# Altium schematic sheet IMU_sensor_mcu.SchDoc
size 594 x 420 mm; SheetNumber: 1; SheetTotal: 4
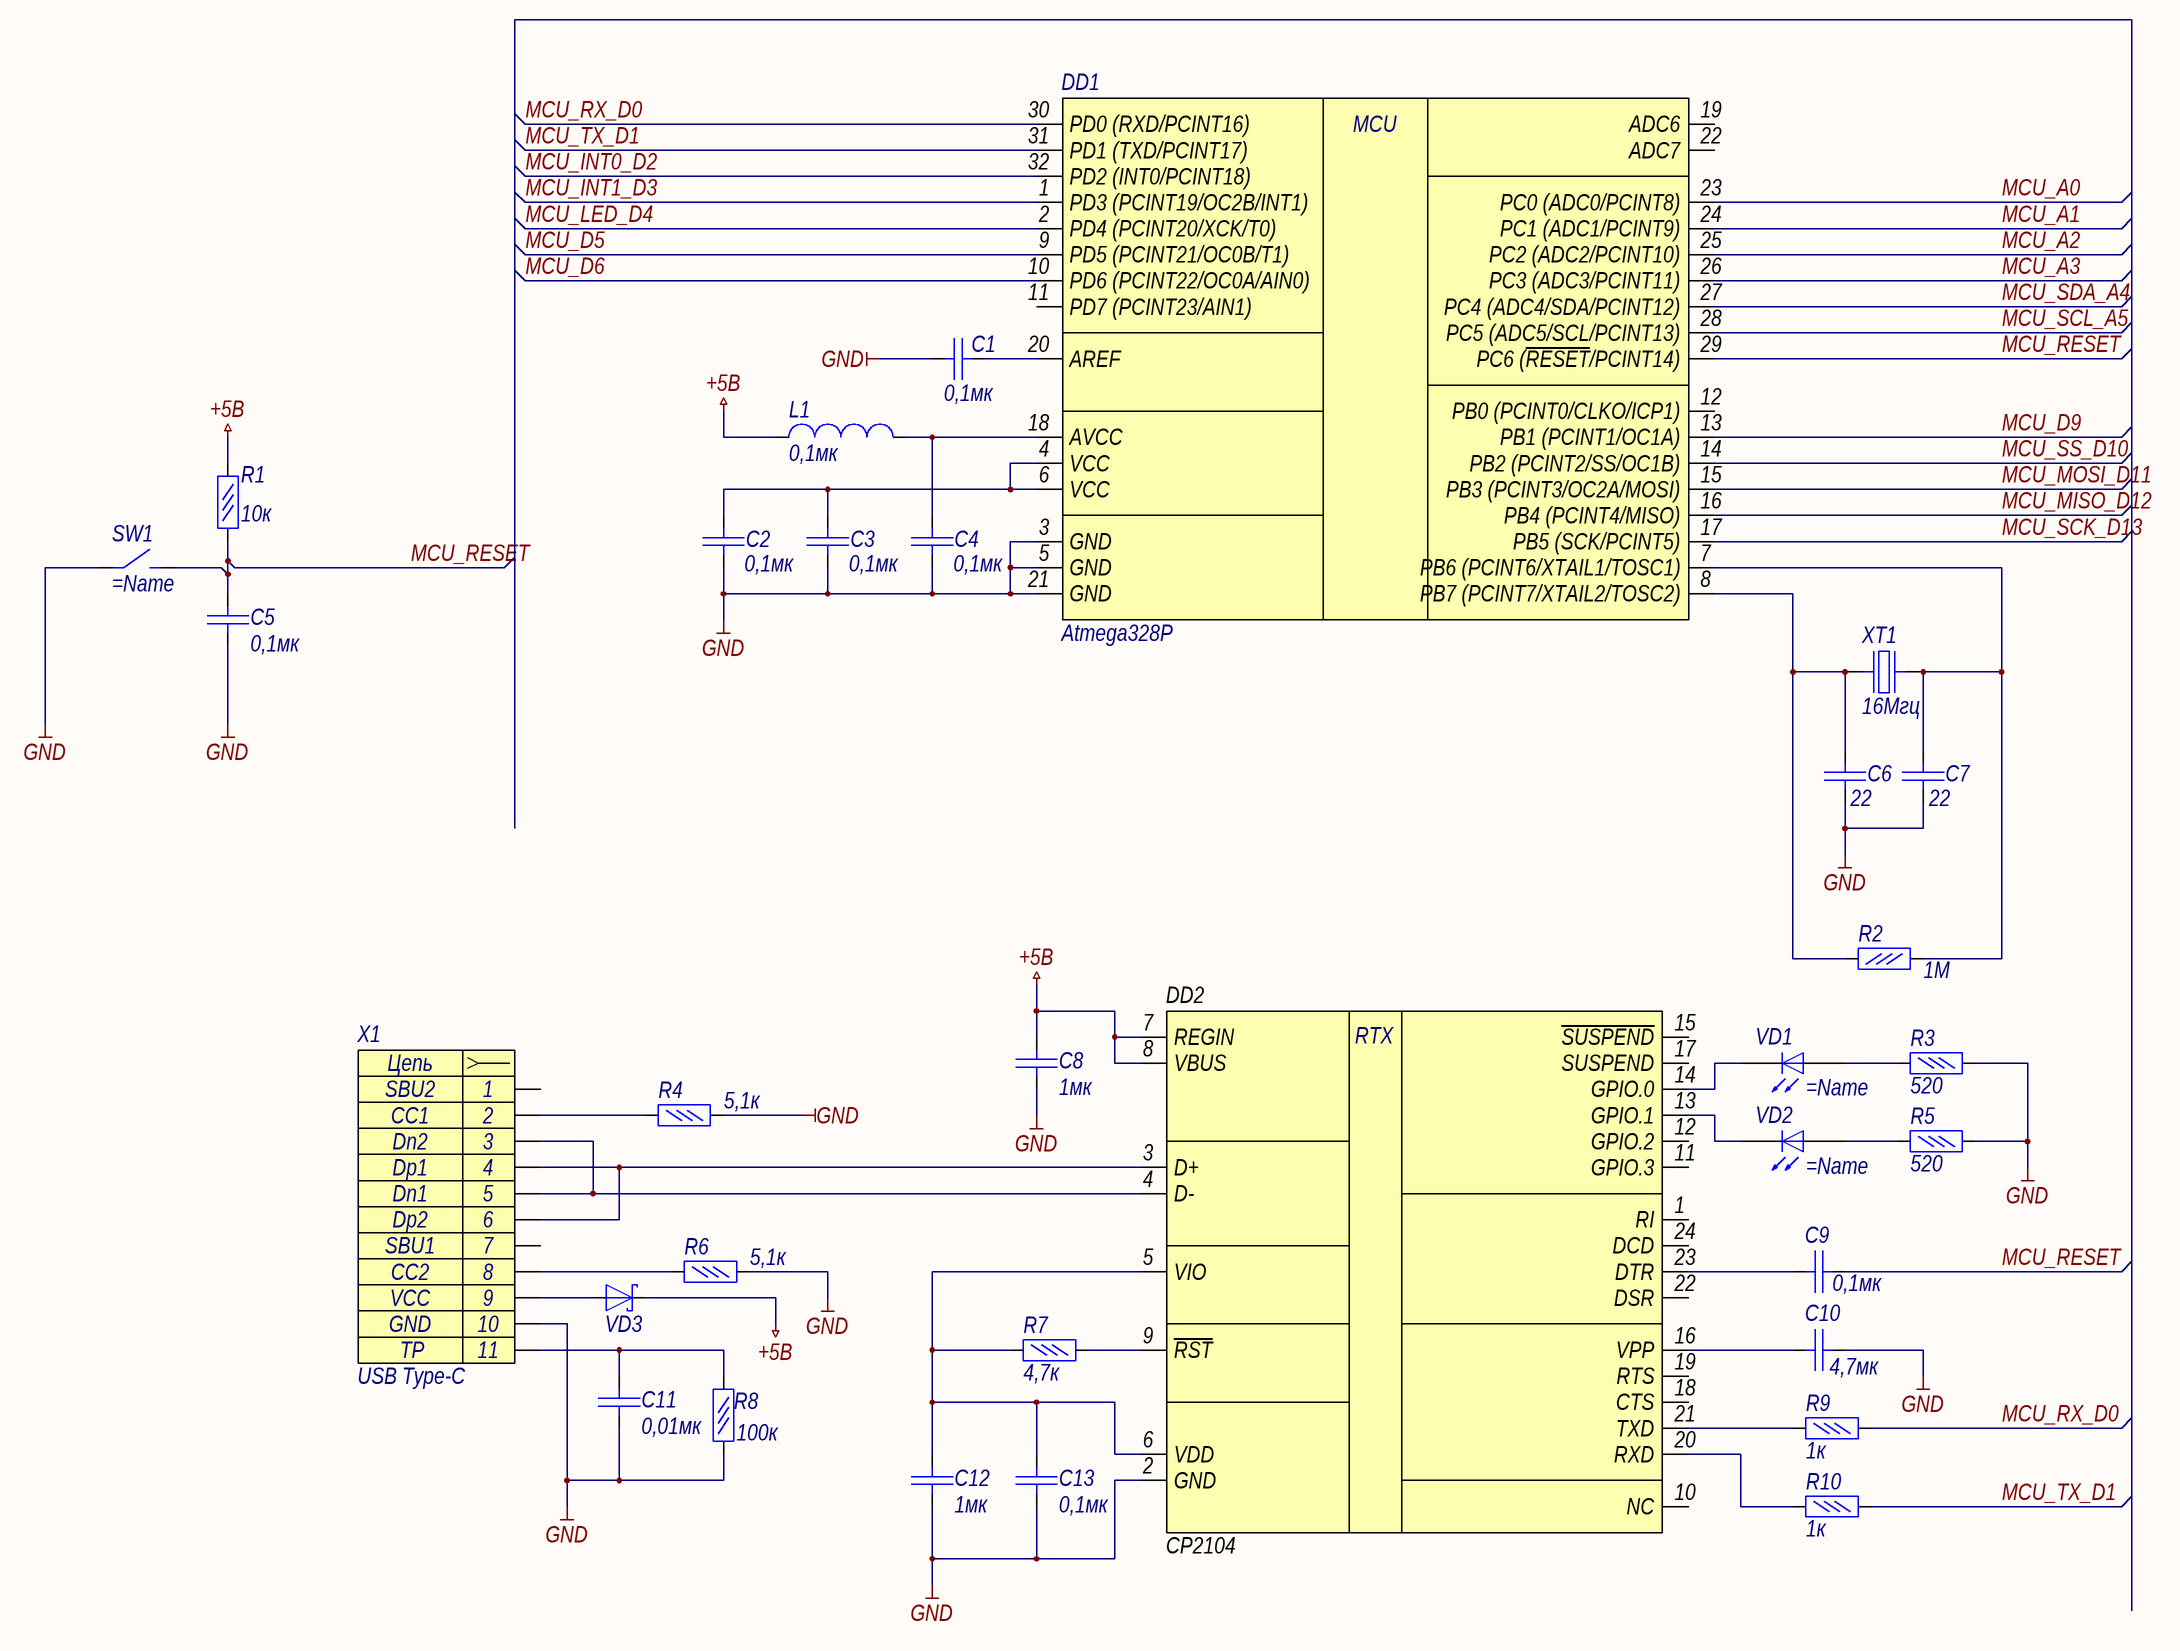
[diagram p0: IMU_sensor_mcu.SchDoc]

## Parts
DD1  Atmega328P  [VQFN32]
DD2  CP2104  [QFN24-PAD]
L1  0,1мк  [L0603]
R1  10к  [R0402]
R2  1М  [R0402]
R3  520  [R0402]
R4  5,1к  [R0402]
R5  520  [R0402]
R6  5,1к  [R0402]
R7  4,7к  [R0402]
R8  100к  [R0402]
R9  1к  [R0402]
R10  1к  [R0402]
SW1  (no value)  [it-1187]
VD1  (no value)  [0603 - led]
VD2  (no value)  [0603 - led]
VD3  (no value)  [SOD323]
X1  USB Type-C  [USB4105-15-A-120]
XT1  16Мгц  [KX-7]
С1  0,1мк  [C0402]
С2  0,1мк  [C0402]
С3  0,1мк  [C0402]
С4  0,1мк  [C0402]
С5  0,1мк  [C0603]
С6  22  [C0402]
С7  22  [C0402]
С8  1мк  [C0402]
С9  0,1мк  [C0402]
С10  4,7мк  [C0603]
С11  0,01мк  [C0402]
С12  1мк  [C0402]
С13  0,1мк  [C0402]

## Nets
+5В: DD2.7(REGIN) DD2.8(VBUS) L1.2 R1.1 VD3.1(K) С8.1
GND: DD1.3(GND) DD1.5(GND) DD1.21(GND) DD2.2(GND) R3.2 R4.2 R5.2 R6.2 R8.1 SW1.1 X1.10(VCC) С1.1 С2.1 С3.1 С4.1 С5.2 С6.1 С7.1 С8.2 С10.1 С11.1 С12.1 С13.1
MCU_A0: DD1.23(PC0_(ADC0/PCINT8))
MCU_A1: DD1.24(PC1_(ADC1/PCINT9))
MCU_A2: DD1.25(PC2_(ADC2/PCINT10))
MCU_A3: DD1.26(PC3_(ADC3/PCINT11))
MCU_D5: DD1.9(PD5_(PCINT21/OC0B/T1))
MCU_D6: DD1.10(PD6_(PCINT22/OC0A/AIN0))
MCU_D9: DD1.13(PB1_(PCINT1/OC1A))
MCU_INT0_D2: DD1.32(PD2_(INT0/PCINT18))
MCU_INT1_D3: DD1.1(PD3_(PCINT19/OC2B/INT1))
MCU_LED_D4: DD1.2(PD4_(PCINT20/XCK/T0))
MCU_MISO_D12: DD1.16(PB4_(PCINT4/MISO))
MCU_MOSI_D11: DD1.15(PB3_(PCINT3/OC2A/MOSI))
MCU_RESET: DD1.29(PC6_(~{RESET}/PCINT14)) R1.2 SW1.2 С5.1 С9.1
MCU_RX_D0: DD1.30(PD0_(RXD/PCINT16)) R9.2
MCU_SCK_D13: DD1.17(PB5_(SCK/PCINT5))
MCU_SCL_A5: DD1.28(PC5_(ADC5/SCL/PCINT13))
MCU_SDA_A4: DD1.27(PC4_(ADC4/SDA/PCINT12))
MCU_SS_D10: DD1.14(PB2_(PCINT2/SS/OC1B))
MCU_TX_D1: DD1.31(PD1_(TXD/PCINT17)) R10.2
NetDD1_4: DD1.4(VCC) DD1.6(VCC) С2.2 С3.2
NetDD1_7: DD1.7(PB6_(PCINT6/XTAIL1/TOSC1)) R2.2 XT1.3 С7.2
NetDD1_8: DD1.8(PB7_(PCINT7/XTAIL2/TOSC2)) R2.1 XT1.1 С6.2
NetDD1_18: DD1.18(AVCC) L1.1 С4.2
NetDD1_20: DD1.20(AREF) С1.2
NetDD2_3: DD2.3(D+) X1.4(A6) X1.6(B6)
NetDD2_4: DD2.4(D-) X1.3(B7) X1.5(A7)
NetDD2_5: DD2.5(VIO) DD2.6(VDD) R7.2 С12.2 С13.2
NetDD2_9: DD2.9(~{RST}) R7.1
NetDD2_13: DD2.13(GPIO.1) VD2.2(K)
NetDD2_14: DD2.14(GPIO.0) VD1.2(K)
NetDD2_16: DD2.16(VPP) С10.2
NetDD2_20: DD2.20(RXD) R10.1
NetDD2_21: DD2.21(TXD) R9.1
NetDD2_23: DD2.23(DTR) С9.2
NetR3_1: R3.1 VD1.1(A)
NetR4_1: R4.1 X1.2(A5)
NetR5_1: R5.1 VD2.1(A)
NetR6_1: R6.1 X1.8(B5)
NetR8_2: R8.2 X1.TP С11.2
NetVD3_2: VD3.2(A) X1.9(GND)

Not connected (* = marked no-connect by the designer): DD1 11(PD7_(PCINT23/AIN1)) 12(PB0_(PCINT0/CLKO/ICP1)) 19(ADC6) 22(ADC7); DD2 1(RI) 10(NC) 11(GPIO.3) 12(GPIO.2) 15(~{SUSPEND}) 17(SUSPEND) 18(CTS) 19(RTS) 22(DSR) 24(DCD); X1 1(B8) 7(A8)

## Notes on the sheet
- Перв. примен.
- Справ. №
- Подп. и дата
- Инв. № дубл.
- Нормоконтроль:
- Взам. инв. №
- Изм.
- Лист
- № докум.
- Подп.
- Дата
- Лит.
- Масса
- Масштаб
- Т.контр.
- Пров.
- Разраб.
- Листов
- Разработал:
- Инв. № подл.
- Н.контр.
- Утв.
- Копировал
- Формат
- А2
- (in symbol Atmega328P) MCU
- (in symbol CP2104) RTX
- (in symbol USB4105) Цепь; 11

## Library data of the parts
DD1 = Atmega328P: Atmega328P-MU; Name: Atmega328P
L1 = индуктивность: Value: 0,1мк
R1-R10 = Резистор 0.05Вт: Резистор 0,05Вт
  R1: Value: 10к
  R2: Value: 1М
  R3 R5: Value: 520
  R4 R6: Value: 5,1к
  R7: Value: 4,7к
  R8: Value: 100к
  R9 R10: Value: 1к
SW1 = button
VD1 VD2 = smd_led: smd led
VD3 = DiodeSchottky: Диод Шоттки
X1 = USB4105: USB Type-C USB4105-GF-A / GCT; Contact_1: SBU2; Contact_2: CC1; Contact_3: Dn2; Contact_4: Dp1; Contact_5: Dn1; Contact_6: Dp2; Contact_7: SBU1; Contact_8: CC2; Contact_9: VCC; Contact_10: GND; Name: USB Type-C
XT1 = Резонатор: 12.88605 / Geyer; Name: 12.88605; Value: 16Мгц
С1-С13 = Кер. конденсатор
  С1-С5 С9 С13: Value: 0,1мк
  С6 С7: Value: 22
  С8 С12: Value: 1мк
  С10: Value: 4,7мк
  С11: Value: 0,01мк
DD2 = CP2104: Наименование: CP2104